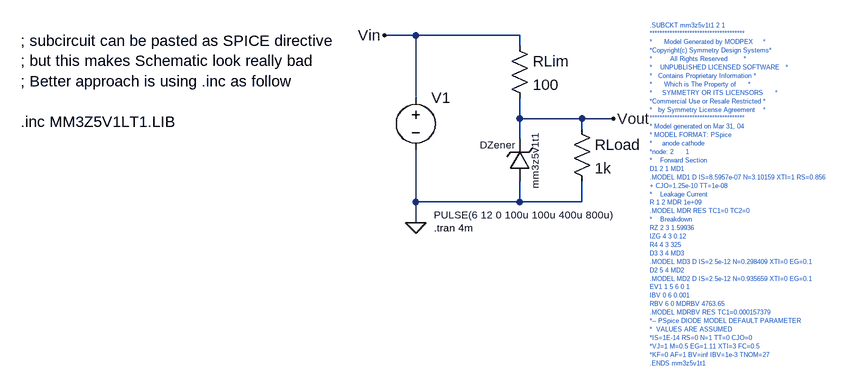
[diagram p0: schematic SUBCKT 5V Zener Voltage Regulator.asc]
SUBCKT 5V Zener Voltage Regulator.asc, the LTspice schematic file:
Version 4
SHEET 1 924 788
WIRE -16 32 -64 32
WIRE 144 32 -16 32
WIRE 144 48 144 32
WIRE -16 128 -16 32
WIRE 144 160 144 128
WIRE 240 160 144 160
WIRE 288 160 240 160
WIRE 240 176 240 160
WIRE 144 192 144 160
WIRE -16 288 -16 208
WIRE 144 288 144 256
WIRE 144 288 -16 288
WIRE 240 288 240 256
WIRE 240 288 144 288
WIRE -16 320 -16 288
FLAG -16 320 0
FLAG -64 32 Vin
FLAG 288 160 Vout
SYMBOL voltage -16 112 R0
WINDOW 123 0 0 Left 0
WINDOW 39 0 0 Left 0
WINDOW 3 28 196 Left 1
SYMATTR InstName V1
SYMATTR Value PULSE(6 12 0 100u 100u 400u 800u)
SYMBOL res 128 32 R0
SYMATTR InstName RLim
SYMATTR Value 100
SYMBOL res 224 160 R0
SYMATTR InstName RLoad
SYMATTR Value 1k
SYMBOL zener 160 256 R180
WINDOW 0 23 56 Left 1
WINDOW 3 -8 -12 VRight 1
SYMATTR InstName DZener
SYMATTR Value mm3z5v1t1
SYMATTR Prefix X
TEXT 12 328 Left 1 !.tran 4m
TEXT 344 16 Left 0 ;.SUBCKT mm3z5v1t1 2 1\n**************************************\n*      Model Generated by MODPEX     *\n*Copyright(c) Symmetry Design Systems*\n*         All Rights Reserved        *\n*    UNPUBLISHED LICENSED SOFTWARE   *\n*   Contains Proprietary Information *\n*      Which is The Property of      *\n*     SYMMETRY OR ITS LICENSORS      *\n*Commercial Use or Resale Restricted *\n*   by Symmetry License Agreement    *\n**************************************\n* Model generated on Mar 31, 04\n* MODEL FORMAT: PSpice\n*     anode cathode\n*node: 2      1\n*    Forward Section\nD1 2 1 MD1\n.MODEL MD1 D IS=8.5957e-07 N=3.10159 XTI=1 RS=0.856\n+ CJO=1.25e-10 TT=1e-08\n*    Leakage Current\nR 1 2 MDR 1e+09 \n.MODEL MDR RES TC1=0 TC2=0\n*    Breakdown\nRZ 2 3 1.59936\nIZG 4 3 0.12\nR4 4 3 325\nD3 3 4 MD3\n.MODEL MD3 D IS=2.5e-12 N=0.298409 XTI=0 EG=0.1\nD2 5 4 MD2\n.MODEL MD2 D IS=2.5e-12 N=0.935659 XTI=0 EG=0.1\nEV1 1 5 6 0 1\nIBV 0 6 0.001\nRBV 6 0 MDRBV 4763.65\n.MODEL MDRBV RES TC1=0.000157379\n*-- PSpice DIODE MODEL DEFAULT PARAMETER\n*  VALUES ARE ASSUMED\n*IS=1E-14 RS=0 N=1 TT=0 CJO=0\n*VJ=1 M=0.5 EG=1.11 XTI=3 FC=0.5\n*KF=0 AF=1 BV=inf IBV=1e-3 TNOM=27\n.ENDS mm3z5v1t1
TEXT -624 40 Left 2 !; subcircuit can be pasted as SPICE directive\n; but this makes Schematic look really bad\n; Better approach is using .inc as follow\n \n.inc MM3Z5V1LT1.LIB

The netlist it stands for:
* SUBCKT 5V Zener Voltage Regulator.asc
V1 Vin 0 PULSE(6 12 0 100u 100u 400u 800u)
RLim Vin Vout 100
RLoad Vout 0 1k
XDZener 0 Vout mm3z5v1t1  ; pins + -
.tran 4m
* .SUBCKT mm3z5v1t1 2 1
* **************************************
* *      Model Generated by MODPEX     *
* *Copyright(c) Symmetry Design Systems*
* *         All Rights Reserved        *
* *    UNPUBLISHED LICENSED SOFTWARE   *
* *   Contains Proprietary Information *
* *      Which is The Property of      *
* *     SYMMETRY OR ITS LICENSORS      *
* *Commercial Use or Resale Restricted *
* *   by Symmetry License Agreement    *
* **************************************
* * Model generated on Mar 31, 04
* * MODEL FORMAT: PSpice
* *     anode cathode
* *node: 2      1
* *    Forward Section
* D1 2 1 MD1
* .MODEL MD1 D IS=8.5957e-07 N=3.10159 XTI=1 RS=0.856
* + CJO=1.25e-10 TT=1e-08
* *    Leakage Current
* R 1 2 MDR 1e+09
* .MODEL MDR RES TC1=0 TC2=0
* *    Breakdown
* RZ 2 3 1.59936
* IZG 4 3 0.12
* R4 4 3 325
* D3 3 4 MD3
* .MODEL MD3 D IS=2.5e-12 N=0.298409 XTI=0 EG=0.1
* D2 5 4 MD2
* .MODEL MD2 D IS=2.5e-12 N=0.935659 XTI=0 EG=0.1
* EV1 1 5 6 0 1
* IBV 0 6 0.001
* RBV 6 0 MDRBV 4763.65
* .MODEL MDRBV RES TC1=0.000157379
* *-- PSpice DIODE MODEL DEFAULT PARAMETER
* *  VALUES ARE ASSUMED
* *IS=1E-14 RS=0 N=1 TT=0 CJO=0
* *VJ=1 M=0.5 EG=1.11 XTI=3 FC=0.5
* *KF=0 AF=1 BV=inf IBV=1e-3 TNOM=27
* .ENDS mm3z5v1t1
; subcircuit can be pasted as SPICE directive
; but this makes Schematic look really bad
; Better approach is using .inc as follow
.inc MM3Z5V1LT1.LIB
.backanno
.end